# Altium schematic sheet core_logique.SchDoc
size A3; PageSetup: Record=PageOptions|CenterHorizontal=True|CenterVertical=True|PrintScale=1.00|XCorrection=1.00|YCorrection=1.00|PrintKind=1|BorderSize=5000000|LeftOffset=0|BottomOffset=0|Orientation=2|PaperLength=1000|PaperWidth=1000|Scale=100|PaperSource=7|PrintQuality=-3|MediaType=1|DitherType=10|PrintScaleMode=1|PaperKind=A4|PaperIndex=9
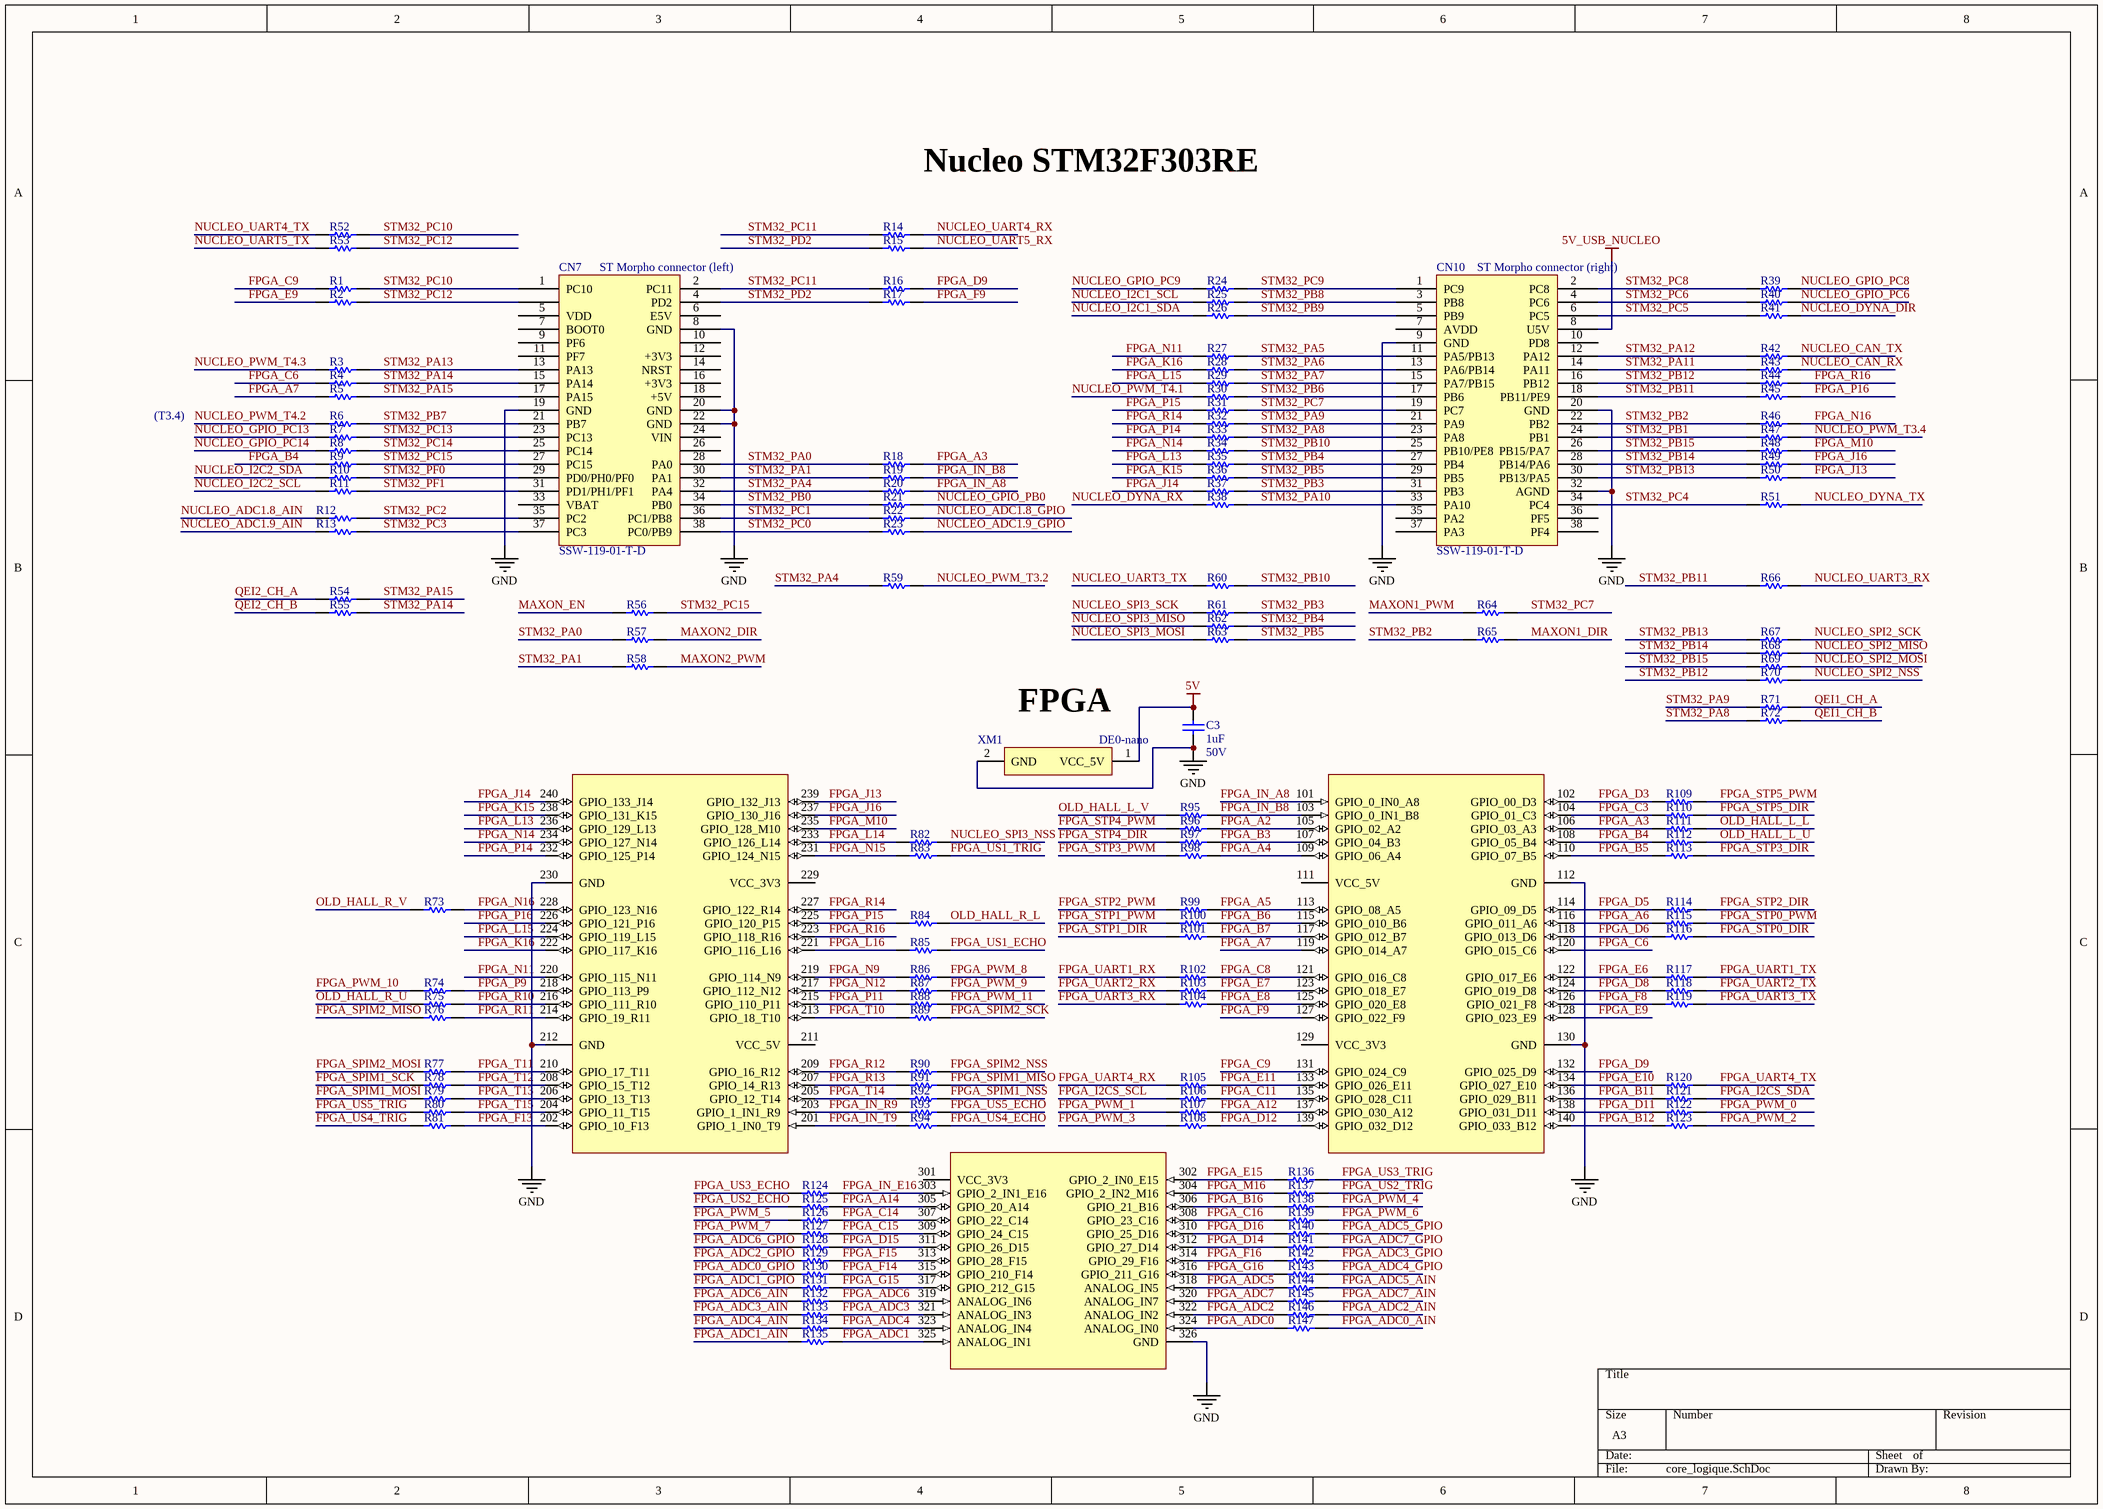
[diagram p0: core_logique.SchDoc]

## Parts
C3  1uF  RatedVoltage: 50V  [WCAP-CSGP_0805, 2x1.25x1.25]
CN7  SSW-119-01-T-D  [CONN RCPT .100" 38POS DUAL TIN]
CN10  SSW-119-01-T-D  [CONN RCPT .100" 38POS DUAL TIN]
R1  RC0402FR-0722RL  [RESC1005X04N]  (value not drawn)
R2  RC0402FR-0722RL  [RESC1005X04N]  (value not drawn)
R3  RC0402FR-0722RL  [RESC1005X04N]  (value not drawn)
R4  RC0402FR-0722RL  [RESC1005X04N]  (value not drawn)
R5  RC0402FR-0722RL  [RESC1005X04N]  (value not drawn)
R6  RC0402FR-0722RL  [RESC1005X04N]  (value not drawn)
R7  RC0402FR-0722RL  [RESC1005X04N]  (value not drawn)
R8  RC0402FR-0722RL  [RESC1005X04N]  (value not drawn)
R9  RC0402FR-0722RL  [RESC1005X04N]  (value not drawn)
R10  RC0402FR-0722RL  [RESC1005X04N]  (value not drawn)
R11  RC0402FR-0722RL  [RESC1005X04N]  (value not drawn)
R12  RC0402FR-0722RL  [RESC1005X04N]  (value not drawn)
R13  RC0402FR-0722RL  [RESC1005X04N]  (value not drawn)
R14  RC0402FR-0722RL  [RESC1005X04N]  (value not drawn)
R15  RC0402FR-0722RL  [RESC1005X04N]  (value not drawn)
R16  RC0402FR-0722RL  [RESC1005X04N]  (value not drawn)
R17  RC0402FR-0722RL  [RESC1005X04N]  (value not drawn)
R18  RC0402FR-0722RL  [RESC1005X04N]  (value not drawn)
R19  RC0402FR-0722RL  [RESC1005X04N]  (value not drawn)
R20  RC0402FR-0722RL  [RESC1005X04N]  (value not drawn)
R21  RC0402FR-0722RL  [RESC1005X04N]  (value not drawn)
R22  RC0402FR-0722RL  [RESC1005X04N]  (value not drawn)
R23  RC0402FR-0722RL  [RESC1005X04N]  (value not drawn)
R24  RC0402FR-0722RL  [RESC1005X04N]  (value not drawn)
R25  RC0402FR-0722RL  [RESC1005X04N]  (value not drawn)
R26  RC0402FR-0722RL  [RESC1005X04N]  (value not drawn)
R27  RC0402FR-0722RL  [RESC1005X04N]  (value not drawn)
R28  RC0402FR-0722RL  [RESC1005X04N]  (value not drawn)
R29  RC0402FR-0722RL  [RESC1005X04N]  (value not drawn)
R30  RC0402FR-0722RL  [RESC1005X04N]  (value not drawn)
R31  RC0402FR-0722RL  [RESC1005X04N]  (value not drawn)
R32  RC0402FR-0722RL  [RESC1005X04N]  (value not drawn)
R33  RC0402FR-0722RL  [RESC1005X04N]  (value not drawn)
R34  RC0402FR-0722RL  [RESC1005X04N]  (value not drawn)
R35  RC0402FR-0722RL  [RESC1005X04N]  (value not drawn)
R36  RC0402FR-0722RL  [RESC1005X04N]  (value not drawn)
R37  RC0402FR-0722RL  [RESC1005X04N]  (value not drawn)
R38  RC0402FR-0722RL  [RESC1005X04N]  (value not drawn)
R39  RC0402FR-0722RL  [RESC1005X04N]  (value not drawn)
R40  RC0402FR-0722RL  [RESC1005X04N]  (value not drawn)
R41  RC0402FR-0722RL  [RESC1005X04N]  (value not drawn)
R42  RC0402FR-0722RL  [RESC1005X04N]  (value not drawn)
R43  RC0402FR-0722RL  [RESC1005X04N]  (value not drawn)
R44  RC0402FR-0722RL  [RESC1005X04N]  (value not drawn)
R45  RC0402FR-0722RL  [RESC1005X04N]  (value not drawn)
R46  RC0402FR-0722RL  [RESC1005X04N]  (value not drawn)
R47  RC0402FR-0722RL  [RESC1005X04N]  (value not drawn)
R48  RC0402FR-0722RL  [RESC1005X04N]  (value not drawn)
R49  RC0402FR-0722RL  [RESC1005X04N]  (value not drawn)
R50  RC0402FR-0722RL  [RESC1005X04N]  (value not drawn)
R51  RC0402FR-0722RL  [RESC1005X04N]  (value not drawn)
R52  RC0402FR-0722RL  [RESC1005X04N]  (value not drawn)
R53  RC0402FR-0722RL  [RESC1005X04N]  (value not drawn)
R54  RC0402FR-0722RL  [RESC1005X04N]  (value not drawn)
R55  RC0402FR-0722RL  [RESC1005X04N]  (value not drawn)
R56  RC0402FR-0722RL  [RESC1005X04N]  (value not drawn)
R57  RC0402FR-0722RL  [RESC1005X04N]  (value not drawn)
R58  RC0402FR-0722RL  [RESC1005X04N]  (value not drawn)
R59  RC0402FR-0722RL  [RESC1005X04N]  (value not drawn)
R60  RC0402FR-0722RL  [RESC1005X04N]  (value not drawn)
R61  RC0402FR-0722RL  [RESC1005X04N]  (value not drawn)
R62  RC0402FR-0722RL  [RESC1005X04N]  (value not drawn)
R63  RC0402FR-0722RL  [RESC1005X04N]  (value not drawn)
R64  RC0402FR-0722RL  [RESC1005X04N]  (value not drawn)
R65  RC0402FR-0722RL  [RESC1005X04N]  (value not drawn)
R66  RC0402FR-0722RL  [RESC1005X04N]  (value not drawn)
R67  RC0402FR-0722RL  [RESC1005X04N]  (value not drawn)
R68  RC0402FR-0722RL  [RESC1005X04N]  (value not drawn)
R69  RC0402FR-0722RL  [RESC1005X04N]  (value not drawn)
R70  RC0402FR-0722RL  [RESC1005X04N]  (value not drawn)
R71  RC0402FR-0722RL  [RESC1005X04N]  (value not drawn)
R72  RC0402FR-0722RL  [RESC1005X04N]  (value not drawn)
R73  RC0402FR-0722RL  [RESC1005X04N]  (value not drawn)
R74  RC0402FR-0722RL  [RESC1005X04N]  (value not drawn)
R75  RC0402FR-0722RL  [RESC1005X04N]  (value not drawn)
R76  RC0402FR-0722RL  [RESC1005X04N]  (value not drawn)
R77  RC0402FR-0722RL  [RESC1005X04N]  (value not drawn)
R78  RC0402FR-0722RL  [RESC1005X04N]  (value not drawn)
R79  RC0402FR-0722RL  [RESC1005X04N]  (value not drawn)
R80  RC0402FR-0722RL  [RESC1005X04N]  (value not drawn)
R81  RC0402FR-0722RL  [RESC1005X04N]  (value not drawn)
R82  RC0402FR-0722RL  [RESC1005X04N]  (value not drawn)
R83  RC0402FR-0722RL  [RESC1005X04N]  (value not drawn)
R84  RC0402FR-0722RL  [RESC1005X04N]  (value not drawn)
R85  RC0402FR-0722RL  [RESC1005X04N]  (value not drawn)
R86  RC0402FR-0722RL  [RESC1005X04N]  (value not drawn)
R87  RC0402FR-0722RL  [RESC1005X04N]  (value not drawn)
R88  RC0402FR-0722RL  [RESC1005X04N]  (value not drawn)
R89  RC0402FR-0722RL  [RESC1005X04N]  (value not drawn)
R90  RC0402FR-0722RL  [RESC1005X04N]  (value not drawn)
R91  RC0402FR-0722RL  [RESC1005X04N]  (value not drawn)
R92  RC0402FR-0722RL  [RESC1005X04N]  (value not drawn)
R93  RC0402FR-0722RL  [RESC1005X04N]  (value not drawn)
R94  RC0402FR-0722RL  [RESC1005X04N]  (value not drawn)
R95  RC0402FR-0722RL  [RESC1005X04N]  (value not drawn)
R96  RC0402FR-0722RL  [RESC1005X04N]  (value not drawn)
R97  RC0402FR-0722RL  [RESC1005X04N]  (value not drawn)
R98  RC0402FR-0722RL  [RESC1005X04N]  (value not drawn)
R99  RC0402FR-0722RL  [RESC1005X04N]  (value not drawn)
R100  RC0402FR-0722RL  [RESC1005X04N]  (value not drawn)
R101  RC0402FR-0722RL  [RESC1005X04N]  (value not drawn)
R102  RC0402FR-0722RL  [RESC1005X04N]  (value not drawn)
R103  RC0402FR-0722RL  [RESC1005X04N]  (value not drawn)
R104  RC0402FR-0722RL  [RESC1005X04N]  (value not drawn)
R105  RC0402FR-0722RL  [RESC1005X04N]  (value not drawn)
R106  RC0402FR-0722RL  [RESC1005X04N]  (value not drawn)
R107  RC0402FR-0722RL  [RESC1005X04N]  (value not drawn)
R108  RC0402FR-0722RL  [RESC1005X04N]  (value not drawn)
R109  RC0402FR-0722RL  [RESC1005X04N]  (value not drawn)
R110  RC0402FR-0722RL  [RESC1005X04N]  (value not drawn)
R111  RC0402FR-0722RL  [RESC1005X04N]  (value not drawn)
R112  RC0402FR-0722RL  [RESC1005X04N]  (value not drawn)
R113  RC0402FR-0722RL  [RESC1005X04N]  (value not drawn)
R114  RC0402FR-0722RL  [RESC1005X04N]  (value not drawn)
R115  RC0402FR-0722RL  [RESC1005X04N]  (value not drawn)
R116  RC0402FR-0722RL  [RESC1005X04N]  (value not drawn)
R117  RC0402FR-0722RL  [RESC1005X04N]  (value not drawn)
R118  RC0402FR-0722RL  [RESC1005X04N]  (value not drawn)
R119  RC0402FR-0722RL  [RESC1005X04N]  (value not drawn)
R120  RC0402FR-0722RL  [RESC1005X04N]  (value not drawn)
R121  RC0402FR-0722RL  [RESC1005X04N]  (value not drawn)
R122  RC0402FR-0722RL  [RESC1005X04N]  (value not drawn)
R123  RC0402FR-0722RL  [RESC1005X04N]  (value not drawn)
R124  RC0402FR-0722RL  [RESC1005X04N]  (value not drawn)
R125  RC0402FR-0722RL  [RESC1005X04N]  (value not drawn)
R126  RC0402FR-0722RL  [RESC1005X04N]  (value not drawn)
R127  RC0402FR-0722RL  [RESC1005X04N]  (value not drawn)
R128  RC0402FR-0722RL  [RESC1005X04N]  (value not drawn)
R129  RC0402FR-0722RL  [RESC1005X04N]  (value not drawn)
R130  RC0402FR-0722RL  [RESC1005X04N]  (value not drawn)
R131  RC0402FR-0722RL  [RESC1005X04N]  (value not drawn)
R132  RC0402FR-0722RL  [RESC1005X04N]  (value not drawn)
R133  RC0402FR-0722RL  [RESC1005X04N]  (value not drawn)
R134  RC0402FR-0722RL  [RESC1005X04N]  (value not drawn)
R135  RC0402FR-0722RL  [RESC1005X04N]  (value not drawn)
R136  RC0402FR-0722RL  [RESC1005X04N]  (value not drawn)
R137  RC0402FR-0722RL  [RESC1005X04N]  (value not drawn)
R138  RC0402FR-0722RL  [RESC1005X04N]  (value not drawn)
R139  RC0402FR-0722RL  [RESC1005X04N]  (value not drawn)
R140  RC0402FR-0722RL  [RESC1005X04N]  (value not drawn)
R141  RC0402FR-0722RL  [RESC1005X04N]  (value not drawn)
R142  RC0402FR-0722RL  [RESC1005X04N]  (value not drawn)
R143  RC0402FR-0722RL  [RESC1005X04N]  (value not drawn)
R144  RC0402FR-0722RL  [RESC1005X04N]  (value not drawn)
R145  RC0402FR-0722RL  [RESC1005X04N]  (value not drawn)
R146  RC0402FR-0722RL  [RESC1005X04N]  (value not drawn)
R147  RC0402FR-0722RL  [RESC1005X04N]  (value not drawn)
XM1  DE0-nano  [DE0-NANO]

## Nets
5V: C3.2 XM1.1(VCC_5V)
5V_USB_NUCLEO: CN10.8(U5V)
GND: C3.1 CN7.8(GND) CN7.19(GND) CN7.20(GND) CN7.22(GND) CN10.9(GND) CN10.20(GND) CN10.32(AGND) XM1.2(GND) XM1.112(GND) XM1.130(GND) XM1.212(GND) XM1.230(GND) XM1.326(GND)
FPGA_A2: R96.2 XM1.105(GPIO_02_A2)
FPGA_A3: R18.1 R111.1 XM1.106(GPIO_03_A3)
FPGA_A4: R98.2 XM1.109(GPIO_06_A4)
FPGA_A5: R99.2 XM1.113(GPIO_08_A5)
FPGA_A6: R115.1 XM1.116(GPIO_011_A6)
FPGA_A7: R5.1 XM1.119(GPIO_014_A7)
FPGA_A12: R107.2 XM1.137(GPIO_030_A12)
FPGA_A14: R125.2 XM1.305(GPIO_20_A14)
FPGA_ADC0: R147.1 XM1.324(ANALOG_IN0)
FPGA_ADC0_AIN: R147.2
FPGA_ADC0_GPIO: R130.1
FPGA_ADC1: R135.2 XM1.325(ANALOG_IN1)
FPGA_ADC1_AIN: R135.1
FPGA_ADC1_GPIO: R131.1
FPGA_ADC2: R146.1 XM1.322(ANALOG_IN2)
FPGA_ADC2_AIN: R146.2
FPGA_ADC2_GPIO: R129.1
FPGA_ADC3: R133.2 XM1.321(ANALOG_IN3)
FPGA_ADC3_AIN: R133.1
FPGA_ADC3_GPIO: R142.2
FPGA_ADC4: R134.2 XM1.323(ANALOG_IN4)
FPGA_ADC4_AIN: R134.1
FPGA_ADC4_GPIO: R143.2
FPGA_ADC5: R144.1 XM1.318(ANALOG_IN5)
FPGA_ADC5_AIN: R144.2
FPGA_ADC5_GPIO: R140.2
FPGA_ADC6: R132.2 XM1.319(ANALOG_IN6)
FPGA_ADC6_AIN: R132.1
FPGA_ADC6_GPIO: R128.1
FPGA_ADC7: R145.1 XM1.320(ANALOG_IN7)
FPGA_ADC7_AIN: R145.2
FPGA_ADC7_GPIO: R141.2
FPGA_B3: R97.2 XM1.107(GPIO_04_B3)
FPGA_B4: R9.1 R112.1 XM1.108(GPIO_05_B4)
FPGA_B5: R113.1 XM1.110(GPIO_07_B5)
FPGA_B6: R100.2 XM1.115(GPIO_010_B6)
FPGA_B7: R101.2 XM1.117(GPIO_012_B7)
FPGA_B11: R121.1 XM1.136(GPIO_029_B11)
FPGA_B12: R123.1 XM1.140(GPIO_033_B12)
FPGA_B16: R138.1 XM1.306(GPIO_21_B16)
FPGA_C3: R110.1 XM1.104(GPIO_01_C3)
FPGA_C6: R4.1 XM1.120(GPIO_015_C6)
FPGA_C8: R102.2 XM1.121(GPIO_016_C8)
FPGA_C9: R1.1 XM1.131(GPIO_024_C9)
FPGA_C11: R106.2 XM1.135(GPIO_028_C11)
FPGA_C14: R126.2 XM1.307(GPIO_22_C14)
FPGA_C15: R127.2 XM1.309(GPIO_24_C15)
FPGA_C16: R139.1 XM1.308(GPIO_23_C16)
FPGA_D3: R109.1 XM1.102(GPIO_00_D3)
FPGA_D5: R114.1 XM1.114(GPIO_09_D5)
FPGA_D6: R116.1 XM1.118(GPIO_013_D6)
FPGA_D8: R118.1 XM1.124(GPIO_019_D8)
FPGA_D9: R16.1 XM1.132(GPIO_025_D9)
FPGA_D11: R122.1 XM1.138(GPIO_031_D11)
FPGA_D12: R108.2 XM1.139(GPIO_032_D12)
FPGA_D14: R141.1 XM1.312(GPIO_27_D14)
FPGA_D15: R128.2 XM1.311(GPIO_26_D15)
FPGA_D16: R140.1 XM1.310(GPIO_25_D16)
FPGA_E6: R117.1 XM1.122(GPIO_017_E6)
FPGA_E7: R103.2 XM1.123(GPIO_018_E7)
FPGA_E8: R104.2 XM1.125(GPIO_020_E8)
FPGA_E9: R2.1 XM1.128(GPIO_023_E9)
FPGA_E10: R120.1 XM1.134(GPIO_027_E10)
FPGA_E11: R105.2 XM1.133(GPIO_026_E11)
FPGA_E15: R136.1 XM1.302(GPIO_2_IN0_E15)
FPGA_F8: R119.1 XM1.126(GPIO_021_F8)
FPGA_F9: R17.1 XM1.127(GPIO_022_F9)
FPGA_F13: R81.2 XM1.202(GPIO_10_F13)
FPGA_F14: R130.2 XM1.315(GPIO_210_F14)
FPGA_F15: R129.2 XM1.313(GPIO_28_F15)
FPGA_F16: R142.1 XM1.314(GPIO_29_F16)
FPGA_G15: R131.2 XM1.317(GPIO_212_G15)
FPGA_G16: R143.1 XM1.316(GPIO_211_G16)
FPGA_I2CS_SCL: R106.1
FPGA_I2CS_SDA: R121.2
FPGA_IN_A8: R20.1 XM1.101(GPIO_0_IN0_A8)
FPGA_IN_B8: R19.1 R95.2 XM1.103(GPIO_0_IN1_B8)
FPGA_IN_E16: R124.2 XM1.303(GPIO_2_IN1_E16)
FPGA_IN_R9: R93.1 XM1.203(GPIO_1_IN1_R9)
FPGA_IN_T9: R94.1 XM1.201(GPIO_1_IN0_T9)
FPGA_J13: R50.1 XM1.239(GPIO_132_J13)
FPGA_J14: R37.2 XM1.240(GPIO_133_J14)
FPGA_J16: R49.1 XM1.237(GPIO_130_J16)
FPGA_K15: R36.2 XM1.238(GPIO_131_K15)
FPGA_K16: R28.2 XM1.222(GPIO_117_K16)
FPGA_L13: R35.2 XM1.236(GPIO_129_L13)
FPGA_L14: R82.1 XM1.233(GPIO_126_L14)
FPGA_L15: R29.2 XM1.224(GPIO_119_L15)
FPGA_L16: R85.1 XM1.221(GPIO_116_L16)
FPGA_M10: R48.1 XM1.235(GPIO_128_M10)
FPGA_M16: R137.1 XM1.304(GPIO_2_IN2_M16)
FPGA_N9: R86.1 XM1.219(GPIO_114_N9)
FPGA_N11: R27.2 XM1.220(GPIO_115_N11)
FPGA_N12: R87.1 XM1.217(GPIO_112_N12)
FPGA_N14: R34.2 XM1.234(GPIO_127_N14)
FPGA_N15: R83.1 XM1.231(GPIO_124_N15)
FPGA_N16: R46.1 R73.2 XM1.228(GPIO_123_N16)
FPGA_P9: R74.2 XM1.218(GPIO_113_P9)
FPGA_P11: R88.1 XM1.215(GPIO_110_P11)
FPGA_P14: R33.2 XM1.232(GPIO_125_P14)
FPGA_P15: R31.2 R84.1 XM1.225(GPIO_120_P15)
FPGA_P16: R45.1 XM1.226(GPIO_121_P16)
FPGA_PWM_0: R122.2
FPGA_PWM_1: R107.1
FPGA_PWM_2: R123.2
FPGA_PWM_3: R108.1
FPGA_PWM_4: R138.2
FPGA_PWM_5: R126.1
FPGA_PWM_6: R139.2
FPGA_PWM_7: R127.1
FPGA_PWM_8: R86.2
FPGA_PWM_9: R87.2
FPGA_PWM_10: R74.1
FPGA_PWM_11: R88.2
FPGA_R10: R75.2 XM1.216(GPIO_111_R10)
FPGA_R11: R76.2 XM1.214(GPIO_19_R11)
FPGA_R12: R90.1 XM1.209(GPIO_16_R12)
FPGA_R13: R91.1 XM1.207(GPIO_14_R13)
FPGA_R14: R32.2 XM1.227(GPIO_122_R14)
FPGA_R16: R44.1 XM1.223(GPIO_118_R16)
FPGA_SPIM1_MISO: R91.2
FPGA_SPIM1_MOSI: R79.1
FPGA_SPIM1_NSS: R92.2
FPGA_SPIM1_SCK: R78.1
FPGA_SPIM2_MISO: R76.1
FPGA_SPIM2_MOSI: R77.1
FPGA_SPIM2_NSS: R90.2
FPGA_SPIM2_SCK: R89.2
FPGA_STP0_DIR: R116.2
FPGA_STP0_PWM: R115.2
FPGA_STP1_DIR: R101.1
FPGA_STP1_PWM: R100.1
FPGA_STP2_DIR: R114.2
FPGA_STP2_PWM: R99.1
FPGA_STP3_DIR: R113.2
FPGA_STP3_PWM: R98.1
FPGA_STP4_DIR: R97.1
FPGA_STP4_PWM: R96.1
FPGA_STP5_DIR: R110.2
FPGA_STP5_PWM: R109.2
FPGA_T10: R89.1 XM1.213(GPIO_18_T10)
FPGA_T11: R77.2 XM1.210(GPIO_17_T11)
FPGA_T12: R78.2 XM1.208(GPIO_15_T12)
FPGA_T13: R79.2 XM1.206(GPIO_13_T13)
FPGA_T14: R92.1 XM1.205(GPIO_12_T14)
FPGA_T15: R80.2 XM1.204(GPIO_11_T15)
FPGA_UART1_RX: R102.1
FPGA_UART1_TX: R117.2
FPGA_UART2_RX: R103.1
FPGA_UART2_TX: R118.2
FPGA_UART3_RX: R104.1
FPGA_UART3_TX: R119.2
FPGA_UART4_RX: R105.1
FPGA_UART4_TX: R120.2
FPGA_US1_ECHO: R85.2
FPGA_US1_TRIG: R83.2
FPGA_US2_ECHO: R125.1
FPGA_US2_TRIG: R137.2
FPGA_US3_ECHO: R124.1
FPGA_US3_TRIG: R136.2
FPGA_US4_ECHO: R94.2
FPGA_US4_TRIG: R81.1
FPGA_US5_ECHO: R93.2
FPGA_US5_TRIG: R80.1
MAXON1_DIR: R65.2
MAXON1_PWM: R64.1
MAXON2_DIR: R57.1
MAXON2_PWM: R58.1
MAXON_EN: R56.2
NUCLEO_ADC1.8_AIN: R12.2
NUCLEO_ADC1.8_GPIO: R22.1
NUCLEO_ADC1.9_AIN: R13.2
NUCLEO_ADC1.9_GPIO: R23.1
NUCLEO_CAN_RX: R43.1
NUCLEO_CAN_TX: R42.1
NUCLEO_DYNA_DIR: R41.1
NUCLEO_DYNA_RX: R38.2
NUCLEO_DYNA_TX: R51.1
NUCLEO_GPIO_PB0: R21.1
NUCLEO_GPIO_PC6: R40.1
NUCLEO_GPIO_PC8: R39.1
NUCLEO_GPIO_PC9: R24.2
NUCLEO_GPIO_PC13: R7.1
NUCLEO_GPIO_PC14: R8.1
NUCLEO_I2C1_SCL: R25.2
NUCLEO_I2C1_SDA: R26.2
NUCLEO_I2C2_SCL: R11.2
NUCLEO_I2C2_SDA: R10.1
NUCLEO_PWM_T3.2: R59.1
NUCLEO_PWM_T3.4: R47.1
NUCLEO_PWM_T4.1: R30.2
NUCLEO_PWM_T4.2: R6.1
NUCLEO_PWM_T4.3: R3.1
NUCLEO_SPI2_MISO: R68.2
NUCLEO_SPI2_MOSI: R69.2
NUCLEO_SPI2_NSS: R70.2
NUCLEO_SPI2_SCK: R67.2
NUCLEO_SPI3_MISO: R62.2
NUCLEO_SPI3_MOSI: R63.2
NUCLEO_SPI3_NSS: R82.2
NUCLEO_SPI3_SCK: R61.2
NUCLEO_UART3_RX: R66.2
NUCLEO_UART3_TX: R60.2
NUCLEO_UART4_RX: R14.1
NUCLEO_UART4_TX: R52.2
NUCLEO_UART5_RX: R15.1
NUCLEO_UART5_TX: R53.2
OLD_HALL_L_L: R111.2
OLD_HALL_L_U: R112.2
OLD_HALL_L_V: R95.1
OLD_HALL_R_L: R84.2
OLD_HALL_R_U: R75.1
OLD_HALL_R_V: R73.1
QEI1_CH_A: R71.2
QEI1_CH_B: R72.2
QEI2_CH_A: R54.2
QEI2_CH_B: R55.2
STM32_PA0: CN7.28(PA0) R18.2 R57.2
STM32_PA1: CN7.30(PA1) R19.2 R58.2
STM32_PA4: CN7.32(PA4) R20.2 R59.2
STM32_PA5: CN10.11(PA5/PB13) R27.1
STM32_PA6: CN10.13(PA6/PB14) R28.1
STM32_PA7: CN10.15(PA7/PB15) R29.1
STM32_PA8: CN10.23(PA8) R33.1 R72.1
STM32_PA9: CN10.21(PA9) R32.1 R71.1
STM32_PA10: CN10.33(PA10) R38.1
STM32_PA11: CN10.14(PA11) R43.2
STM32_PA12: CN10.12(PA12) R42.2
STM32_PA13: CN7.13(PA13) R3.2
STM32_PA14: CN7.15(PA14) R4.2 R55.1
STM32_PA15: CN7.17(PA15) R5.2 R54.1
STM32_PB0: CN7.34(PB0) R21.2
STM32_PB1: CN10.24(PB1) R47.2
STM32_PB2: CN10.22(PB2) R46.2 R65.1
STM32_PB3: CN10.31(PB3) R37.1 R61.1
STM32_PB4: CN10.27(PB4) R35.1 R62.1
STM32_PB5: CN10.29(PB5) R36.1 R63.1
STM32_PB6: CN10.17(PB6) R30.1
STM32_PB7: CN7.21(PB7) R6.2
STM32_PB8: CN10.3(PB8) R25.1
STM32_PB9: CN10.5(PB9) R26.1
STM32_PB10: CN10.25(PB10/PE8) R34.1 R60.1
STM32_PB11: CN10.18(PB11/PE9) R45.2 R66.1
STM32_PB12: CN10.16(PB12) R44.2 R70.1
STM32_PB13: CN10.30(PB13/PA5) R50.2 R67.1
STM32_PB14: CN10.28(PB14/PA6) R49.2 R68.1
STM32_PB15: CN10.26(PB15/PA7) R48.2 R69.1
STM32_PC0: CN7.38(PC0/PB9) R23.2
STM32_PC1: CN7.36(PC1/PB8) R22.2
STM32_PC2: CN7.35(PC2) R12.1
STM32_PC3: CN7.37(PC3) R13.1
STM32_PC4: CN10.34(PC4) R51.2
STM32_PC5: CN10.6(PC5) R41.2
STM32_PC6: CN10.4(PC6) R40.2
STM32_PC7: CN10.19(PC7) R31.1 R64.2
STM32_PC8: CN10.2(PC8) R39.2
STM32_PC9: CN10.1(PC9) R24.1
STM32_PC10: CN7.1(PC10) R1.2 R52.1
STM32_PC11: CN7.2(PC11) R14.2 R16.2
STM32_PC12: CN7.3(PC12) R2.2 R53.1
STM32_PC13: CN7.23(PC13) R7.2
STM32_PC14: CN7.25(PC14) R8.2
STM32_PC15: CN7.27(PC15) R9.2 R56.1
STM32_PD2: CN7.4(PD2) R15.2 R17.2
STM32_PF0: CN7.29(PD0/PH0/PF0) R10.2
STM32_PF1: CN7.31(PD1/PH1/PF1) R11.1

Not connected (* = marked no-connect by the designer): CN7 5(VDD) 6(E5V) 7(BOOT0) 9(PF6) 10 11(PF7) 12(+3V3) 14(NRST) 16(+3V3) 18(+5V) 24(VIN) 26 33(VBAT); CN10 7(AVDD) 10(PD8) 35(PA2) 36(PF5) 37(PA3) 38(PF4); XM1 12(nc) 111(VCC_5V) 129(VCC_3V3) 211(VCC_5V) 229(VCC_3V3) 301(VCC_3V3)

## Notes on the sheet
- Nucleo STM32F303RE
- (near CN7) ST Morpho connector (left)
- (near CN10) ST Morpho connector (right)
- (T3.4)
- (near XM1) FPGA

## Library data of the parts
C3 = WCAP-CSGP, 885012207103: CAP CER 1uF 50V X7R 0805; Manufacturer: Wurth Elektronik; PublishedDate: Aug 2016; ComponentLink1Description: Manufacturer; ComponentLink1URL: http://www.we-online.de; ComponentLink2Description: Datasheet; ComponentLink2URL: http://katalog.we-online.com/pbs/datasheet/885012207103.pdf; Manufacturer Part Number: 885012207103; Value: 1uF; Size: 0805; CeramicType: X7R
CN7 CN10 = SSW-119-01-T-D: CONN RCPT .100" 38POS DUAL TIN; Manufacturer: Samtec Inc.; Supplier 1: Farnell; Supplier Part Number 1: 2667437; Manufacturer Part Number: SSW-119-01-T-D; ComponentLink1URL: http://suddendocs.samtec.com/prints/ssw-1xx-xx-xxx-x-xx-xxx-xx-mkt.pdf; ComponentLink1Description: http://suddendocs.samtec.com/prints/ssw-1xx-xx-xxx-x-xx-xxx-xx-mkt.pdf
R1-R147 = RC0402FR-0722RL: RES SMD 22 OHM 1% 1/16W 0402; Manufacturer: Yageo; Power: 63mW; Vmax: 50V; Value: 22; Type: Thick Film; ComponentLink1Description: Manufacturer; ComponentLink1URL: http://www.yageo.com/NewPortal/_en/index.jsp; ComponentLink2Description: Datasheet; ComponentLink2URL: http://www.farnell.com/datasheets/2167052.pdf; Manufacturer Part Number: RC0402FR-0722RL; Supplier 1: Farnell; Supplier Part Number 1: 9239030; Precision: ±1%
XM1 = DE0-nano: Manufacturer: TERASIC; Manufacturer Part Number: DE0-nano